# Altium schematic sheet One_Digit_7_Seg_Display.SchDoc
size A4
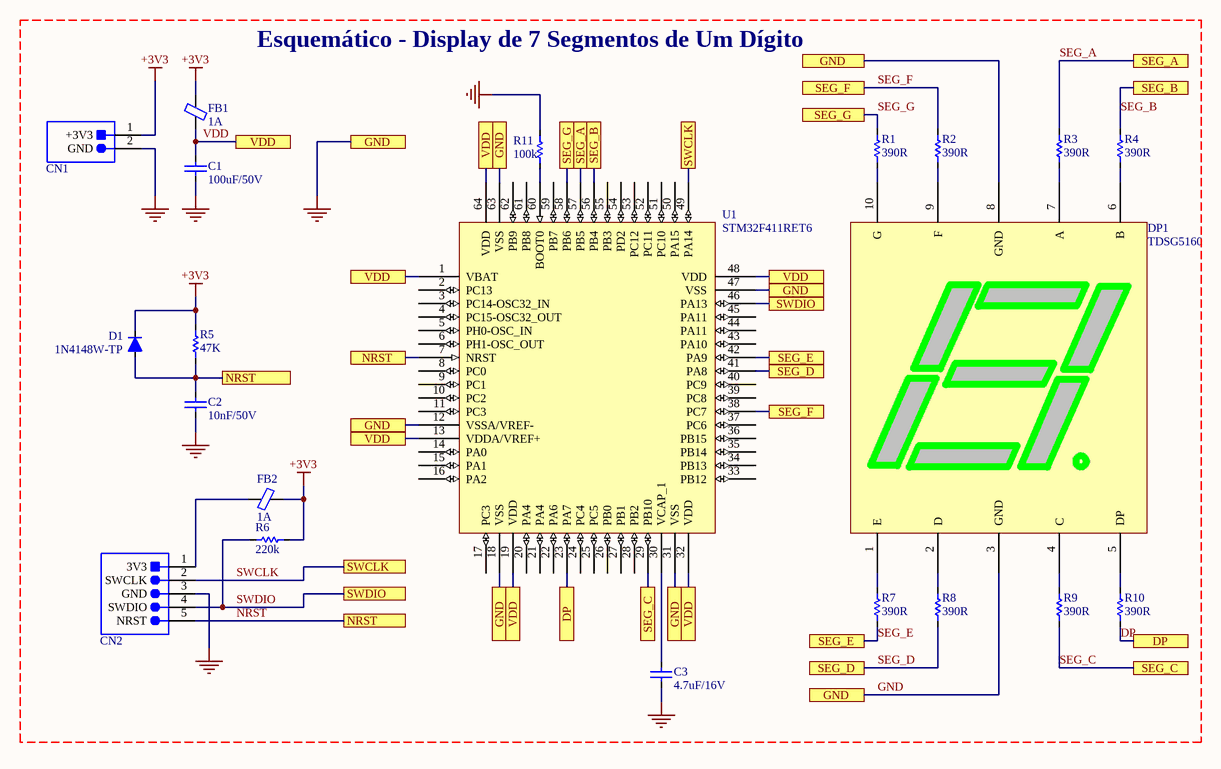
[diagram p0: One_Digit_7_Seg_Display.SchDoc]

## Parts
C1  100uF/50V  [Capacitor 0805]
C2  10nF/50V  [Capacitor 0805]
C3  4.7uF/16V  [Capacitor 0805 4.7uF]
CN1  PCMC2-02 - Alimentação +3V3  [Header Male Horizontal 2X1]  (value not drawn)
CN2  PCMC2-05 - Gravacao STM32  [Header Macho Horizontal 5x1 - Gravacao STM32]  (value not drawn)
D1  1N4148W-TP  [SOD123]
DP1  TDSG5160  [TDSG5160]
FB1  1A  [Ferrite 0805]
FB2  1A  [Ferrite 0805]
R1  390R  [Resistor 0805 390R]
R2  390R  [Resistor 0805 390R]
R3  390R  [Resistor 0805 390R]
R4  390R  [Resistor 0805 390R]
R5  47K  [Resistor 0805 47k]
R6  220k  [Resistor 0805 220k]
R7  390R  [Resistor 0805 390R]
R8  390R  [Resistor 0805 390R]
R9  390R  [Resistor 0805 390R]
R10  390R  [Resistor 0805 390R]
R11  100k  [RESISTOR 0805 100K]
U1  STM32F411RET6  [LQFP64]

## Blocks framed on the sheet
Esquemático - Display de 7 Segmentos de Um Dígito: C1-C3 CN1 CN2 D1 DP1 FB1 FB2 R1-R11 U1

## Ports
DP, GND, NRST, SEG_A, SEG_B, SEG_C, SEG_D, SEG_E, SEG_F, SEG_G, SWCLK, SWDIO, VDD

## Nets
+3V3: CN1.1(+3V3) D1.2(K) FB1.2 FB2.2 R5.2 R6.2
GND: C1.1 C2.1 C3.1 CN1.2(GND) CN2.3(GND) DP1.3(GND) DP1.8(GND) R11.2 U1.12(VSSA/VREF-) U1.18(VSS) U1.31(VSS) U1.47(VSS) U1.63(VSS) ; port GND
DP: R10.1 U1.23(PA7) ; port DP
NRST: C2.2 CN2.5(NRST) D1.1(A) R5.1 U1.7(NRST) ; port NRST
SEG_A: R3.2 U1.57(PB5) ; port SEG_A
SEG_B: R4.2 U1.56(PB4) ; port SEG_B
SEG_C: R9.1 U1.29(PB10) ; port SEG_C
SEG_D: R8.1 U1.41(PA8) ; port SEG_D
SEG_E: R7.1 U1.42(PA9) ; port SEG_E
SEG_F: R2.2 U1.38(PC7) ; port SEG_F
SEG_G: R1.2 U1.58(PB6) ; port SEG_G
SWCLK: CN2.2(SWCLK) U1.49(PA14) ; port SWCLK
SWDIO: CN2.4(SWDIO) R6.1 U1.46(PA13) ; port SWDIO
VDD: C1.2 FB1.1 U1.1(VBAT) U1.13(VDDA/VREF+) U1.19(VDD) U1.32(VDD) U1.48(VDD) U1.64(VDD) ; port VDD
NetC3_2: C3.2 U1.30(VCAP_1)
NetCN2_1: CN2.1(3V3) FB2.1
NetDP1_1: DP1.1(E) R7.2
NetDP1_2: DP1.2(D) R8.2
NetDP1_4: DP1.4(C) R9.2
NetDP1_5: DP1.5(DP) R10.2
NetDP1_6: DP1.6(B) R4.1
NetDP1_7: DP1.7(A) R3.1
NetDP1_9: DP1.9(F) R2.1
NetDP1_10: DP1.10(G) R1.1
NetR11_1: R11.1 U1.60(BOOT0)

Not connected (* = marked no-connect by the designer): U1 2(PC13) 3(PC14-OSC32_IN) 4(PC15-OSC32_OUT) 5(PH0-OSC_IN) 6(PH1-OSC_OUT) 8(PC0) 9(PC1) 10(PC2) 11(PC3) 14(PA0) 15(PA1) 16(PA2) 17(PC3) 20(PA4) 21(PA4) 22(PA6) 24(PC4) 25(PC5) 26(PB0) 27(PB1) 28(PB2) 33(PB12) 34(PB13) 35(PB14) 36(PB15) 37(PC6) 39(PC8) 40(PC9) 43(PA10) 44(PA11) 45(PA11) 50(PA15) 51(PC10) 52(PC11) 53(PC12) 54(PD2) 55(PB3) 59(PB7) 61(PB8) 62(PB9)

## Library data of the parts
C1 = CC0805MRX7R9BB104: Cap Ceramic 0.1uF 50V X7R 20% SMD 0805 125C Paper T/R; Manufacturer: Yageo; Capacitance: 100nF; Supplier 1: Digi-Key; Manufacturer Part Number: CC0805MRX7R9BB104; Stock 1: 3755; Pricing 1: 1 = 0,16000, 10 = 0,11400, 50 = 0,06460, 100 = 0,05350, 500 = 0,03754, 1000 = 0,03108 (USD); RoHS: Yes; Mount: Surface Mount; Case/Package: 0805; Min Operating Temperature: -55°C; Max Operating Temperature: 125°C; Tolerance: 20%; Packaging: Tape and Reel; Dielectric: X7R; Voltage Rating: 50V; Voltage Rating (DC): 50V; Length: 0.079inch; Width: 0.049inch; Thickness: 0.037inch; Depth: 1.25mm; Lead Free: Lead Free; Halogen Free: Halogen Free; ComponentLink1URL: https://datasheet.ciiva.com/13207/upy-gphc-x7r-6-3v-to-50v-8-12304-13207535.pdf?src-supplier=Mouser; ComponentLink1Description: https://datasheet.ciiva.com/13207/upy-gphc-x7r-6-3v-to-50v-8-12304-13207535.pdf?src-supplier=Mouser; Supplier Part Number 1: 311-4351-1-ND
C2 = C0805X103F5GEC7210: Cap Cer 0805 10NF 50V C0G 1%; Manufacturer: KEMET; Supplier 1: Digi-Key; Manufacturer Part Number: C0805X103F5GEC7210; Stock 1: 0; Pricing 1: 10000 = 0,10290 (USD); Supplier Part Number 1: C0805X103F5GEC7210-ND
C3 = C0805C475M4PACTU: Multilayer Ceramic Capacitors MLCC - SMD/SMT 16volts 4.7uF X5R 20%; Manufacturer: KEMET; Voltage Rating: 16V; Dissipation Factor: 5%; Supplier 1: Digi-Key; Manufacturer Part Number: C0805C475M4PACTU; Stock 1: 4513; Pricing 1: 1 = 0,54000, 10 = 0,37800, 50 = 0,26460, 100 = 0,22690, 500 = 0,17016, 1000 = 0,14369 (USD); RoHS: Yes; Mount: Surface Mount; Case/Package: 0805; Case Code (Metric): 2012; Case Code (Imperial): 0805; Dielectric Material: Ceramic; Min Operating Temperature: -55°C; Max Operating Temperature: 85°C; Capacitance: 4.7uF; Tolerance: 20%; Packaging: Tape and Reel; Package Quantity: 1; Voltage Rating (DC): 16V; Dielectric: X5R; Termination: SMD/SMT; Length: 2mm; Height: 1.25mm; Width: 0.049inch; Thickness: 0.055inch; Lead Pitch: 0.75mm; Depth: 1.25mm; Lead Free: Lead Free; ComponentLink1URL: http://components.arrow.com/part/dataview/40912695S6999520N7429?src-supplier=Arrow; ComponentLink1Description: http://components.arrow.com/part/dataview/40912695S6999520N7429?src-supplier=Arrow; ComponentLink2URL: http://www.mouser.com/ds/2/212/KEM_C1006_X5R_SMD-1103249.pdf?src-supplier=Mouser; ComponentLink2Description: http://www.mouser.com/ds/2/212/KEM_C1006_X5R_SMD-1103249.pdf?src-supplier=Mouser; ComponentLink3URL: https://search.kemet.com/component-edge/download/datasheet/C0805C475M4PACTU.pdf?src-supplier=Digi-Key; ComponentLink3Description: https://search.kemet.com/component-edge/download/datasheet/C0805C475M4PACTU.pdf?src-supplier=Digi-Key; ComponentLink4URL: https://api.kemet.com/component-edge/download/datasheet/C0805C475M4PACTU.pdf?src-supplier=Digi-Key; ComponentLink4Description: https://api.kemet.com/component-edge/download/datasheet/C0805C475M4PACTU.pdf?src-supplier=Digi-Key; Supplier Part Number 1: 399-9249-1-ND
D1 = 1N4148W-TP: MICRO COMMERCIAL COMPONENTS - 1N4148W-TP - SWITCHING DIODE, 150mA, 100V, SOD123, FU; Manufacturer: MCC; Max Surge Current: 2A; Forward Voltage: 1V; Recovery Time: 4ns; Max Reverse Leakage Current: 5uA; Power Dissipation: 400mW; Max Forward Surge Current (Ifsm): 1A; Element Configuration: Single; Polarity: Standard; Capacitance: 4pF; Supplier 1: Digi-Key; Manufacturer Part Number: 1N4148W-TP; Stock 1: 11901; Pricing 1: 1 = 0,17000, 10 = 0,15800, 25 = 0,15000, 100 = 0,06600, 250 = 0,06336, 500 = 0,05184, 1000 = 0,03600 (USD); Mount: Surface Mount; Number of Pins: 2; Min Operating Temperature: -65°C; Max Operating Temperature: 150°C; Packaging: Tape and Reel; Forward Current: 150mA; Package Quantity: 3000; Average Rectified Current: 150mA; Reverse Recovery Time: 4ns; Max Repetitive Reverse Voltage (Vrrm): 100V; Peak Non-Repetitive Surge Current: 2A; Voltage Rating (DC): 100V; Current Rating: 150mA; Output Current: 150mA; Max Reverse Voltage (DC): 100V; Length: 2.85mm; Height: 1.2mm; Width: 1.8mm; Radiation Hardening: No; REACH SVHC: Unknown; Lead Free: Lead Free; ComponentLink1URL: https://datasheet.ciiva.com/16836/1n4148wsod123-16836277.pdf?src-supplier=Future+Electronics; ComponentLink1Description: https://datasheet.ciiva.com/16836/1n4148wsod123-16836277.pdf?src-supplier=Future+Electronics; ComponentLink2URL: https://datasheet.ciiva.com/1243/1684829-1243908.pdf?src-supplier=Newark; ComponentLink2Description: https://datasheet.ciiva.com/1243/1684829-1243908.pdf?src-supplier=Newark; ComponentLink3URL: https://datasheet.ciiva.com/4435/1n4148wsod123-48460-4435223.pdf?src-supplier=Mouser; ComponentLink3Description: https://datasheet.ciiva.com/4435/1n4148wsod123-48460-4435223.pdf?src-supplier=Mouser; ComponentLink4URL: https://datasheet.ciiva.com/911/1n4148wsod123-911676.pdf?src-supplier=Digi-Key; ComponentLink4Description: https://datasheet.ciiva.com/911/1n4148wsod123-911676.pdf?src-supplier=Digi-Key; ComponentLink5URL: https://datasheet.ciiva.com/911/1n4148wsod123-911677.pdf?src-supplier=Digi-Key; ComponentLink5Description: https://datasheet.ciiva.com/911/1n4148wsod123-911677.pdf?src-supplier=Digi-Key; ComponentLink6URL: https://datasheet.ciiva.com/22747/1684829-22747439.pdf?src-supplier=Element14; ComponentLink6Description: https://datasheet.ciiva.com/22747/1684829-22747439.pdf?src-supplier=Element14; ComponentLink7URL: https://datasheet.ciiva.com/14557/70055519-14557767.pdf?src-supplier=Allied+Electronics; ComponentLink7Description: https://datasheet.ciiva.com/14557/70055519-14557767.pdf?src-supplier=Allied+Electronics; ComponentLink8URL: https://datasheet.ciiva.com/7622/1684829-7622556.pdf?src-supplier=Element14; ComponentLink8Description: https://datasheet.ciiva.com/7622/1684829-7622556.pdf?src-supplier=Element14; ComponentLink9URL: https://datasheet.ciiva.com/911/1n4148wsod123-911678.pdf?src-supplier=Digi-Key; ComponentLink9Description: https://datasheet.ciiva.com/911/1n4148wsod123-911678.pdf?src-supplier=Digi-Key; ComponentLink10URL: http://datasheet.octopart.com/1N4148W-TP-Micro-Commercial-datasheet-60845.pdf?src-supplier=Element14; ComponentLink10Description: http://datasheet.octopart.com/1N4148W-TP-Micro-Commercial-datasheet-60845.pdf?src-supplier=Element14; ComponentLink11URL: http://datasheet.octopart.com/1N4148W-TP-Micro-Commercial-datasheet-13551187.pdf?src-supplier=Upverter; ComponentLink11Description: http://datasheet.octopart.com/1N4148W-TP-Micro-Commercial-datasheet-13551187.pdf?src-supplier=Upverter; ComponentLink12URL: http://datasheet.octopart.com/1N4148W-TP-MCC-datasheet-8327246.pdf?src-supplier=Future+Electronics; ComponentLink12Description: http://datasheet.octopart.com/1N4148W-TP-MCC-datasheet-8327246.pdf?src-supplier=Future+Electronics; ComponentLink13URL: http://datasheet.octopart.com/1N4148W-TP-MCC-datasheet-124568.pdf?src-supplier=Future+Electronics; ComponentLink13Description: http://datasheet.octopart.com/1N4148W-TP-MCC-datasheet-124568.pdf?src-supplier=Future+Electronics; ComponentLink14URL: http://datasheet.octopart.com/1N4148W-TP-MCC-datasheet-10003094.pdf?src-supplier=Allied+Electronics; ComponentLink14Description: http://datasheet.octopart.com/1N4148W-TP-MCC-datasheet-10003094.pdf?src-supplier=Allied+Electronics; ComponentLink15URL: http://datasheet.octopart.com/1N4148W-TP-Micro-Commercial-datasheet-11773887.pdf?src-supplier=Arrow; ComponentLink15Description: http://datasheet.octopart.com/1N4148W-TP-Micro-Commercial-datasheet-11773887.pdf?src-supplier=Arrow; ComponentLink16URL: http://datasheet.octopart.com/1N4148W-TP-MCC-datasheet-133511570.pdf?src-supplier=Future+Electronics; ComponentLink16Description: http://datasheet.octopart.com/1N4148W-TP-MCC-datasheet-133511570.pdf?src-supplier=Future+Electronics; ComponentLink17URL: http://datasheet.octopart.com/1N4148W-TP-MCC-datasheet-134792309.pdf?src-supplier=TME; ComponentLink17Description: http://datasheet.octopart.com/1N4148W-TP-MCC-datasheet-134792309.pdf?src-supplier=TME; Supplier Part Number 1: 1N4148WTPMSCT-ND
DP1 = TDSG5160: Displays Module 1DIGIT 8LED Green CC 10-Pin DIP Module; Manufacturer: Vishay Semiconductors; Forward Voltage: 2.4V; Forward Current: 25mA; Luminous Intensity: 9.5mcd; Number of Characters: 1; Max Power Dissipation: 550mW; Test Current: 10mA; Wavelength: 575nm; Element Configuration: Common Cathode; Viewing Area (height): 13mm; Number of Elements: 8; Reverse Voltage: 15V; Character Width: 7.4mm; Number of Segments: 7; Viewing Angle: 50°; Supplier 1: Allied Electronics; Stock 1: 0; Pricing 1: 400 = 0,69900 (USD); RoHS: Yes; Mount: Through Hole,PCB; Case/Package: DIP; Number of Pins: 10; Color: Green; Min Operating Temperature: -40°C; Max Operating Temperature: 85°C; Packaging: Bulk; Package Quantity: 400; Illumination Color: Green; Operating Supply Voltage: 2.4V; Power Dissipation: 550mW; Dominant Wavelength: 575nm; Power Consumption: 550mW; Character Height: 13mm; Number of Positions: 1; Length: 12.25mm; Height: 0.689inch; Width: 0.482inch; Depth: 17.5mm; Radiation Hardening: No; ComponentLink1URL: https://datasheet.ciiva.com/4263/tdsg11-4263936.pdf?src-supplier=Arrow; ComponentLink1Description: https://datasheet.ciiva.com/4263/tdsg11-4263936.pdf?src-supplier=Arrow; ComponentLink2URL: https://datasheet.ciiva.com/4263/tdsl11-4263299.pdf?src-supplier=Arrow; ComponentLink2Description: https://datasheet.ciiva.com/4263/tdsl11-4263299.pdf?src-supplier=Arrow; ComponentLink3URL: https://datasheet.ciiva.com/11771/0900766b80e30a57-11771290.pdf?src-supplier=RSComponents; ComponentLink3Description: https://datasheet.ciiva.com/11771/0900766b80e30a57-11771290.pdf?src-supplier=RSComponents; ComponentLink4URL: https://datasheet.ciiva.com/15136/getdatasheetpartid-44902-15136383.pdf?src-supplier=Verical; ComponentLink4Description: https://datasheet.ciiva.com/15136/getdatasheetpartid-44902-15136383.pdf?src-supplier=Verical; ComponentLink5URL: https://datasheet.ciiva.com/3208/tdsl51-3208469.pdf?src-supplier=Avnet; ComponentLink5Description: https://datasheet.ciiva.com/3208/tdsl51-3208469.pdf?src-supplier=Avnet; ComponentLink6URL: https://datasheet.ciiva.com/14165/xntdsgoy51-14165399.pdf?src-supplier=Distrelec; ComponentLink6Description: https://datasheet.ciiva.com/14165/xntdsgoy51-14165399.pdf?src-supplier=Distrelec; ComponentLink7URL: https://datasheet.ciiva.com/18549/tdsg51-18549816.pdf?src-supplier=Digi-Key; ComponentLink7Description: https://datasheet.ciiva.com/18549/tdsg51-18549816.pdf?src-supplier=Digi-Key; Supplier Part Number 1: 70061451; Manufacturer Part Number: TDSG5160
FB1 FB2 = Bead 1A 0805: FERRITE BEAD 0805 1LN; Manufacturer: Fair-Rite; Manufacturer Part Number: 2508051027Y1; DC Resistance (DCR): 300mR; Test Frequency: 100MHz; Impedance: 1kR; Tolerance: 25%; Supplier 1: Digi-Key; Stock 1: 27360; Pricing 1: 1 = 0,10000, 10 = 0,06100, 25 = 0,05440, 50 = 0,04960, 100 = 0,04460, 250 = 0,03268, 500 = 0,02376, 1000 = 0,02327 (USD); RoHS: Yes; Case/Package: 0805; Min Operating Temperature: -55°C; Max Operating Temperature: 125°C; Max DC Current: 1A; Termination: SMD/SMT; Package Quantity: 4000; Packaging: Tape and Reel; Length: 2mm; Height: 0.9mm; Width: 1.25mm; ComponentLink1URL: https://datasheet.ciiva.com/3855/9132508051027y1-3855886.pdf?src-supplier=Arrow; ComponentLink1Description: https://datasheet.ciiva.com/3855/9132508051027y1-3855886.pdf?src-supplier=Arrow; Supplier Part Number 1: 1934-1009-1-ND
R1-R4 R7-R10 = RC0805JR-07390RL: YAGEO (PHYCOMP)   RC0805JR-07390RL   Surface Mount Chip Resistor, Thick Film, RC Series, 390 ohm, 125 mW,  5%, 150 V; Temperature Coefficient: 100ppm/°C; Power Rating: 125mW; Voltage Rating: 150V; Supplier 1: Digi-Key; Manufacturer: Yageo; Manufacturer Part Number: RC0805JR-07390RL; Stock 1: 479533; Pricing 1: 1 = 0,10000, 10 = 0,03500, 100 = 0,01400, 1000 = 0,00631, 2500 = 0,00548 (USD); RoHS: Yes; Case/Package: 0805; Contact Plating: Tin,Matte,Lead; Case Code (Imperial): 0805; Case Code (Metric): 2012; Min Operating Temperature: -55°C; Max Operating Temperature: 155°C; Composition: Thick Film; Resistance: 390R; Tolerance: 5%; Packaging: Tape and Reel; Termination: SMD/SMT; Number of Terminations: 2; Military Standard: Not; Features: Moisture Resistant; Package Quantity: 1; Max Power Dissipation: 125mW; Length: 2mm; Height: 0.024inch; Width: 1.25mm; Depth: 1.25mm; Radiation Hardening: No; REACH SVHC: Unknown; Lead Free: Lead Free; ComponentLink1URL: https://datasheet.ciiva.com/2519/pyu-r-int-thick-7-2519261.pdf?src-supplier=Digi-Key; ComponentLink1Description: https://datasheet.ciiva.com/2519/pyu-r-int-thick-7-2519261.pdf?src-supplier=Digi-Key; ComponentLink2URL: https://datasheet.ciiva.com/2519/pyu-r-int-thick-7-2519262.pdf?src-supplier=Digi-Key; ComponentLink2Description: https://datasheet.ciiva.com/2519/pyu-r-int-thick-7-2519262.pdf?src-supplier=Digi-Key; ComponentLink3URL: https://datasheet.ciiva.com/2519/pyu-r-int-thick-7-2519263.pdf?src-supplier=Digi-Key; ComponentLink3Description: https://datasheet.ciiva.com/2519/pyu-r-int-thick-7-2519263.pdf?src-supplier=Digi-Key; ComponentLink4URL: https://datasheet.ciiva.com/7941/442941-7941951.pdf?src-supplier=Element14; ComponentLink4Description: https://datasheet.ciiva.com/7941/442941-7941951.pdf?src-supplier=Element14; Supplier Part Number 1: 311-390ARCT-ND
R5 = RC0805JR-0747KL: YAGEO (PHYCOMP)   RC0805JR-0747KL   Surface Mount Chip Resistor, Thick Film, RC Series, 47 kohm, 125 mW,  5%, 150 V; Resistance: 47kR; Power Rating: 125mW; Voltage Rating: 150V; Temperature Coefficient: 100ppm/°C; Supplier 1: Digi-Key; Manufacturer: Yageo; Manufacturer Part Number: RC0805JR-0747KL; Stock 1: 972470; Pricing 1: 1 = 0,10000, 10 = 0,03500, 100 = 0,01400, 1000 = 0,00631, 2500 = 0,00548 (USD); RoHS: Yes; Case/Package: 0805; Contact Plating: Tin,Lead,Matte; Case Code (Imperial): 0805; Case Code (Metric): 2012; Min Operating Temperature: -55°C; Max Operating Temperature: 155°C; Tolerance: 5%; Packaging: Tape and Reel; Termination: SMD/SMT; Composition: Thick Film; Military Standard: Not; Length: 2mm; Depth: 1.25mm; Radiation Hardening: No; REACH SVHC: Unknown; Lead Free: Lead Free; ComponentLink1URL: https://datasheet.ciiva.com/7941/442941-7941967.pdf?src-supplier=Element14; ComponentLink1Description: https://datasheet.ciiva.com/7941/442941-7941967.pdf?src-supplier=Element14; ComponentLink2URL: https://datasheet.ciiva.com/17200/rc0805-17200744.pdf?src-supplier=Future+Electronics; ComponentLink2Description: https://datasheet.ciiva.com/17200/rc0805-17200744.pdf?src-supplier=Future+Electronics; Supplier Part Number 1: 311-47KARCT-ND
R6 = RC0805JR-07220KL: YAGEO - RC0805JR-07220KL - RES, 220K, 5%, 0.125W, 0805, THICK FILM; Resistance: 220kR; Power Rating: 125mW; Voltage Rating: 150V; Temperature Coefficient: 100ppm/°C; Supplier 1: Digi-Key; Manufacturer: Yageo; Manufacturer Part Number: RC0805JR-07220KL; Stock 1: 367499; Pricing 1: 1 = 0,10000, 10 = 0,03500, 100 = 0,01400, 1000 = 0,00631, 2500 = 0,00548 (USD); RoHS: Yes; Case/Package: 0805; Case Code (Metric): 2012; Case Code (Imperial): 0805; Contact Plating: Tin,Matte,Lead; Min Operating Temperature: -55°C; Max Operating Temperature: 155°C; Tolerance: 5%; Package Quantity: 1; Packaging: Tape and Reel; Composition: Thick Film; Number of Terminations: 2; Termination: SMD/SMT; Military Standard: Not; Max Power Dissipation: 125mW; Working Voltage: 150V; Features: Moisture Resistant; Length: 2mm; Height: 0.024inch; Width: 0.049inch; Depth: 1.25mm; Radiation Hardening: No; REACH SVHC: Unknown; Lead Free: Lead Free; ComponentLink1URL: https://datasheet.ciiva.com/5925/442941-5925072.pdf?src-supplier=Farnell; ComponentLink1Description: https://datasheet.ciiva.com/5925/442941-5925072.pdf?src-supplier=Farnell; ComponentLink2URL: https://datasheet.ciiva.com/2456/pyu-r-int-thick-7-2456369.pdf?src-supplier=Digi-Key; ComponentLink2Description: https://datasheet.ciiva.com/2456/pyu-r-int-thick-7-2456369.pdf?src-supplier=Digi-Key; ComponentLink3URL: https://datasheet.ciiva.com/2456/pyu-r-int-thick-7-2456370.pdf?src-supplier=Digi-Key; ComponentLink3Description: https://datasheet.ciiva.com/2456/pyu-r-int-thick-7-2456370.pdf?src-supplier=Digi-Key; ComponentLink4URL: https://datasheet.ciiva.com/2456/pyu-r-int-thick-7-2456371.pdf?src-supplier=Digi-Key; ComponentLink4Description: https://datasheet.ciiva.com/2456/pyu-r-int-thick-7-2456371.pdf?src-supplier=Digi-Key; ComponentLink5URL: https://datasheet.ciiva.com/16741/rc0805-16741415.pdf?src-supplier=Future+Electronics; ComponentLink5Description: https://datasheet.ciiva.com/16741/rc0805-16741415.pdf?src-supplier=Future+Electronics; ComponentLink6URL: https://datasheet.ciiva.com/7941/442941-7941915.pdf?src-supplier=Element14; ComponentLink6Description: https://datasheet.ciiva.com/7941/442941-7941915.pdf?src-supplier=Element14; ComponentLink7URL: https://datasheet.ciiva.com/7941/442941-7941916.pdf?src-supplier=Element14; ComponentLink7Description: https://datasheet.ciiva.com/7941/442941-7941916.pdf?src-supplier=Element14; Supplier Part Number 1: 311-220KARCT-ND
R11 = RC0805JR-07100KL: Res Thick Film 0805 100K Ohm 5% 1/8W 100ppm/C Molded SMD SMD Paper T/R; Manufacturer: Yageo; Temperature Coefficient: 100ppm/°C; Resistance: 100kR; Power Rating: 125mW; Voltage Rating: 150V; Supplier 1: Digi-Key; Manufacturer Part Number: RC0805JR-07100KL; Stock 1: 2684406; Pricing 1: 1 = 0,10000, 10 = 0,03500, 100 = 0,01400, 1000 = 0,00631, 2500 = 0,00548 (USD); RoHS: Yes; Case/Package: 0805; Contact Plating: Tin,Matte,Lead; Case Code (Imperial): 0805; Case Code (Metric): 2012; Min Operating Temperature: -55°C; Max Operating Temperature: 155°C; Composition: Thick Film; Tolerance: 5%; Packaging: Tape and Reel; Termination: SMD/SMT; Military Standard: Not; Length: 2mm; Depth: 1.25mm; Radiation Hardening: No; Lead Free: Lead Free; REACH SVHC: Unknown; ComponentLink1URL: https://datasheet.ciiva.com/7941/442941-7941864.pdf?src-supplier=Element14; ComponentLink1Description: https://datasheet.ciiva.com/7941/442941-7941864.pdf?src-supplier=Element14; ComponentLink2URL: https://datasheet.ciiva.com/7941/442941-7941865.pdf?src-supplier=Element14; ComponentLink2Description: https://datasheet.ciiva.com/7941/442941-7941865.pdf?src-supplier=Element14; ComponentLink3URL: https://datasheet.ciiva.com/15190/getdatasheetpartid-479267-15190029.pdf?src-supplier=Verical; ComponentLink3Description: https://datasheet.ciiva.com/15190/getdatasheetpartid-479267-15190029.pdf?src-supplier=Verical; Supplier Part Number 1: 311-100KARCT-ND
U1 = STM32F411RET6: IC MCU 32BIT 512KB FLASH 64LQFP; Manufacturer: STMicroelectronics; Core Architecture: ARM; Interface: I2C,SPI,USB,IrDA,MMC,SDIO,SD,UART,USART,LIN,I2S; Operating Supply Voltage: 3.3V; Data Bus Width: 32b; Peripherals: Brown-out Detect/Reset,POR,PWM,WDT,DMA; Frequency: 100MHz; Oscillator Type: Internal; Number of I/Os: 50; Min Supply Voltage: 1.7V; Watchdog Timer: Yes; Max Supply Voltage: 3.6V; RAM Size: 128KB; Max Power Dissipation: 313mW; Number of Timers/Counters: 8; Number of ADC Channels: 16; Supplier 1: Digi-Key; Stock 1: 5414; Pricing 1: 1 = 6,81000, 10 = 6,15600, 25 = 5,87000, 100 = 5,09690, 250 = 4,86780, 500 = 4,43828, 1000 = 3,86559, 2500 = 3,72242, 5000 = 3,57925 (USD); RoHS: Yes; Mount: Surface Mount; Case/Package: LQFP; Number of Pins: 64; Weight: 0.012088oz; Min Operating Temperature: -40°C; Max Operating Temperature: 85°C; Packaging: Tray; Package Quantity: 960; Memory Type: FLASH; Memory Size: 512KB; Number of Programmable I/O: 50; Max Frequency: 100MHz; Length: 10mm; Width: 10mm; Radiation Hardening: No; Lead Free: Lead Free; REACH SVHC: No SVHC; ComponentLink1URL: http://www.mouser.com/ds/2/389/stm32f411ce-956237.pdf?src-supplier=Mouser; ComponentLink1Description: http://www.mouser.com/ds/2/389/stm32f411ce-956237.pdf?src-supplier=Mouser; ComponentLink2URL: http://www.farnell.com/datasheets/1941006.pdf?src-supplier=Farnell; ComponentLink2Description: http://www.farnell.com/datasheets/1941006.pdf?src-supplier=Farnell; ComponentLink3URL: http://www.st.com/st-web-ui/static/active/en/resource/technical/document/datasheet/DM00115249.pdf?src-supplier=Avnet; ComponentLink3Description: http://www.st.com/st-web-ui/static/active/en/resource/technical/document/datasheet/DM00115249.pdf?src-supplier=Avnet; ComponentLink4URL: http://www.st.com/content/ccc/resource/technical/document/datasheet/b3/a5/46/3b/b4/e5/4c/85/DM00115249.pdf/files/DM00115249.pdf/jcr:content/translations/en.DM00115249.pdf?src-supplier=Digi-Key; ComponentLink4Description: http://www.st.com/content/ccc/resource/technical/document/datasheet/b3/a5/46/3b/b4/e5/4c/85/DM00115249.pdf/files/DM00115249.pdf/jcr:content/translations/en.DM00115249.pdf?src-supplier=Digi-Key; ComponentLink5URL: http://www.farnell.com/datasheets/1941006.pdf?src-supplier=Newark; ComponentLink5Description: http://www.farnell.com/datasheets/1941006.pdf?src-supplier=Newark; ComponentLink6URL: http://www.farnell.com/datasheets/1869644.pdf?src-supplier=Element14; ComponentLink6Description: http://www.farnell.com/datasheets/1869644.pdf?src-supplier=Element14; Supplier Part Number 1: 497-14909-ND; Manufacturer Part Number: STM32F411RET6